# EasyEDA schematic Vany-RC-v1_2020-09-15_10-33-21.json
TITLE: Sheet_1; REV: 1.0; Date: 2020-05-01; Sheet: 1/1; Drawn By: dmitriyalekcandrovih; Company: Your Company
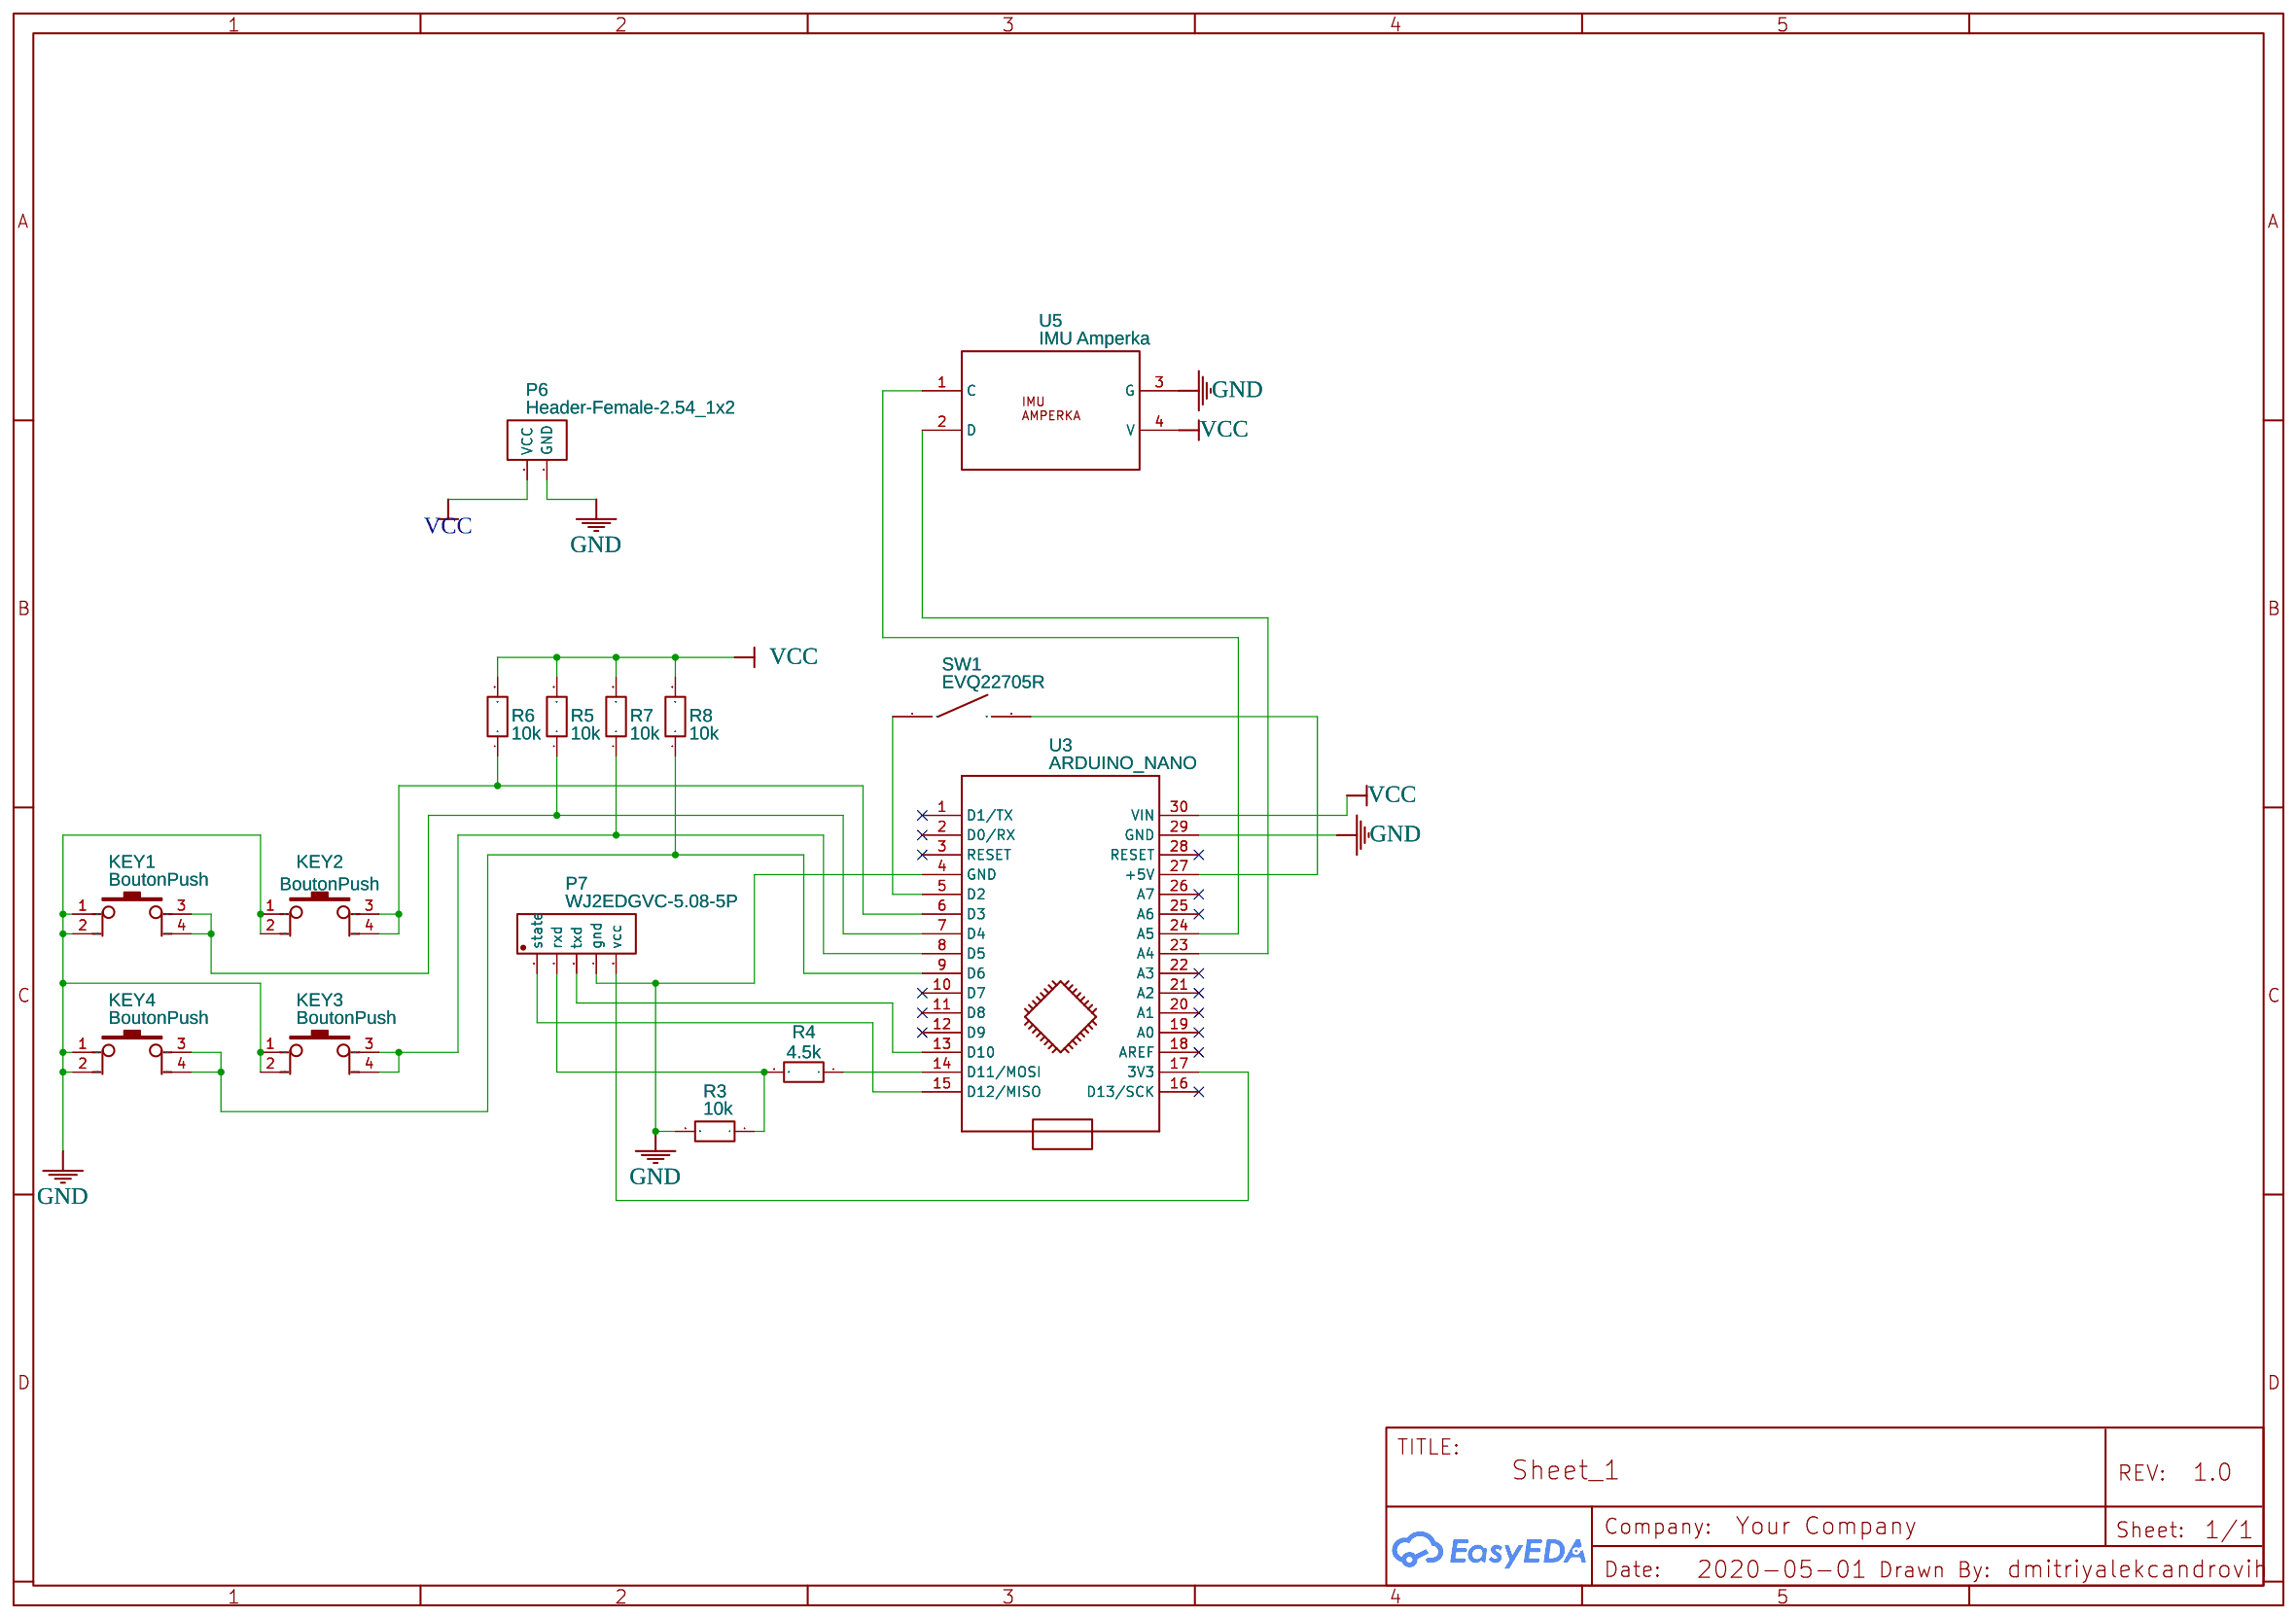
[diagram p0: schematic sheet]

## Parts
KEY1  BoutonPush  [BOUTONPUSH]
KEY2  BoutonPush  [BOUTONPUSH]
KEY3  BoutonPush  [BOUTONPUSH]
KEY4  BoutonPush  [BOUTONPUSH]
P6  Header-Female-2.54_1x2  [HDR-TH_2P-P2.54-V-M]
P7  WJ2EDGVC-5.08-5P  [WJ2EDGVC-5.08-5P]
R3  10k  [AXIAL-0.3]
R4  4.5k  [AXIAL-0.3]
R5  10k  [AXIAL-0.3]
R6  10k  [AXIAL-0.3]
R7  10k  [AXIAL-0.3]
R8  10k  [AXIAL-0.3]
SW1  EVQ22705R  [KEY-6.0*6.0-4]
U3  ARDUINO_NANO  [ARDUINO_NANO]
U5  IMU Amperka  [IMU AMPERKA]

## Library data of the parts
KEY1-KEY4 = BoutonPush: Supplier Part: C59982; Supplier: LCSC; Manufacturer: ReliaPro; Manufacturer Part: button6*6*8; image: http://image.lceda.cn/szlcsc/C59982.jpg; Contributor: digitalPatrick
P6 = Header-Female-2.54_1x2: Supplier: LCSC; Manufacturer: BOOMELE; Manufacturer Part: 2.54-1*2PFemale; image: //image.lceda.cn/szlcsc/C49661.jpg; Supplier Part: C49661
P7 = WJ2EDGVC-5.08-5P: Supplier: LCSC; Manufacturer: ReliaPro; image: //image.lceda.cn/szlcsc/C8423.jpg; Supplier Part: C8423
R3-R8 = Res_AXIAL-0.3(1/8W)_EU
SW1 = EVQ22705R: Supplier: LCSC; Manufacturer: PANASONIC; Contributor: LCSC; Supplier Part: C79156
U3 = ARDUINO_NANO: sourceId: KGSeAWhDB
U5 = IMU Amperka: Contributor: viewfim

## Nets
GND: KEY1.1 KEY1.2 KEY2.1 KEY2.2 KEY3.1 KEY3.2 KEY4.1 KEY4.2 P6.2(GND) P7.4(gnd) R3.2 U3.4(GND) U3.29(GND) U5.3(G)
VCC: P6.1(VCC) R5.2 R6.2 R7.2 R8.2 U3.30(VIN) U5.4(V)
Net-(KEY1-3): KEY1.3 KEY1.4 R5.1 U3.7(D4)
Net-(KEY2-3): KEY2.3 KEY2.4 R6.1 U3.6(D3)
Net-(KEY3-3): KEY3.3 KEY3.4 R7.1 U3.8(D5)
Net-(KEY4-3): KEY4.3 KEY4.4 R8.1 U3.9(D6)
Net-(P7-1): P7.1(state) U3.15(D12/MISO)
Net-(P7-2): P7.2(rxd) R3.1 R4.2
Net-(P7-3): P7.3(txd) U3.13(D10)
Net-(P7-5): P7.5(vcc) U3.17(3V3)
Net-(R4-1): R4.1 U3.14(D11/MOSI)
Net-(SW1-1): SW1.1 U3.5(D2)
Net-(SW1-2): SW1.2 U3.27(+5V)
Net-(U3-23): U3.23(A4) U5.2(D)
Net-(U3-24): U3.24(A5) U5.1(C)

Not connected (* = marked no-connect by the designer): U3 1(D1/TX)* 2(D0/RX)* 3(RESET)* 10(D7)* 11(D8)* 12(D9)* 16(D13/SCK)* 18(AREF)* 19(A0)* 20(A1)* 21(A2)* 22(A3)* 25(A6)* 26(A7)* 28(RESET)*
